# EAGLE schematic temperature_sensor (EAGLE 9.6.2)
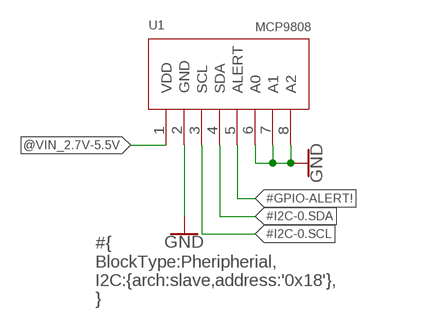
[diagram p0: schematic, sheet 1]

## Parts
U1  MCP9808  [MCP9808]

## Nets
#GPIO-ALERT!: U1.5(ALERT)
#I2C-0.SCL: U1.3(SCL)
#I2C-0.SDA: U1.4(SDA)
@VIN_2.7V-5.5V: U1.1(VDD)
GND: U1.2(GND) U1.6(A0) U1.7(A1) U1.8(A2)

## Notes on the sheet
- #{
  BlockType:Pheripherial,
  I2C:{arch:slave,address:'0x18'},
  }

## Library data of the parts
U1 = MCP9808:MCP9808